# Altium schematic sheet SH26 - ENET PORTS.SchDoc
size 386 x 246 mm
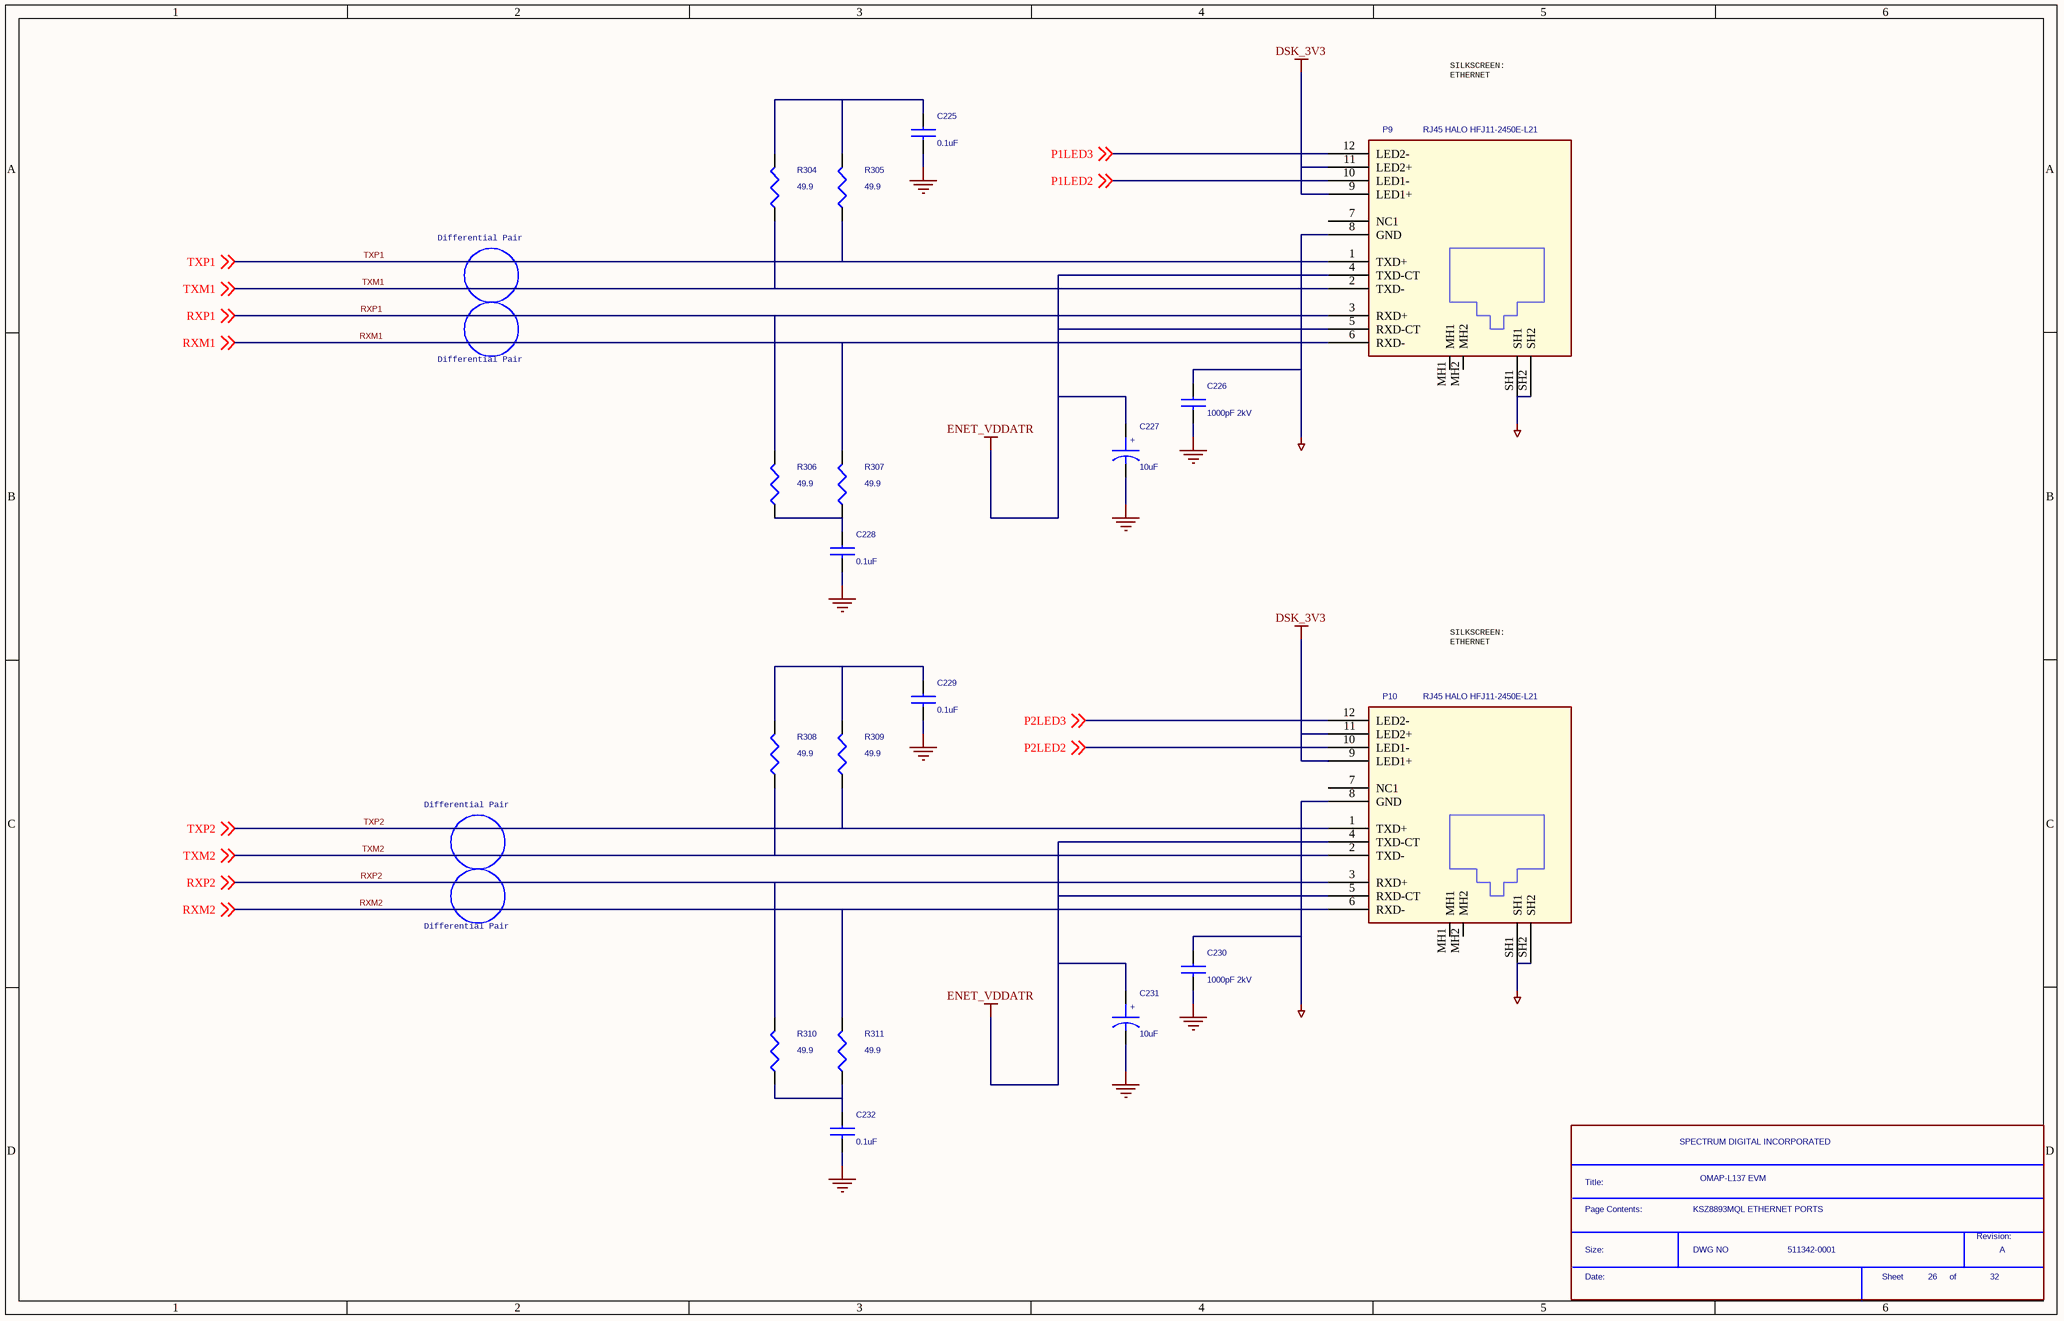
[diagram p0: SH26 - ENET PORTS.SchDoc]

## Parts
*  Page Contents:: KSZ8893MQL ETHERNET PORTS  RevCode: A  Title: OMAP-L137 EVM  OrgName: SPECTRUM DIGITAL INCORPORATED  Doc: 511342-0001  Page Number: 26  Page Count: 32  (hidden comment: SDTitleBlock)  (graphical)
C225  0.1uF  [c402-25]
C226  1000pF 2kV  [EIA1812]
C227  10uF  [c1206-40x70-POL]
C228  0.1uF  [c402-25]
C229  0.1uF  [c402-25]
C230  1000pF 2kV  [EIA1812]
C231  10uF  [c1206-40x70-POL]
C232  0.1uF  [c402-25]
P9  RJ45 HALO HFJ11-2450E-L21  [RJ45AMP556591-1]
P10  RJ45 HALO HFJ11-2450E-L21  [RJ45AMP556591-1]
R304  49.9  [r603-35x45]
R305  49.9  [r603-35x45]
R306  49.9  [r603-35x45]
R307  49.9  [r603-35x45]
R308  49.9  [r603-35x45]
R309  49.9  [r603-35x45]
R310  49.9  [r603-35x45]
R311  49.9  [r603-35x45]

## Nets
DSK_3V3: P9.9(LED1+) P9.11(LED2+) P10.9(LED1+) P10.11(LED2+)
ENET_VDDATR: C227.1 C231.1 P9.4(TXD-CT) P9.5(RXD-CT) P10.4(TXD-CT) P10.5(RXD-CT)
GND: C225.2 C226.2 C227.2 C228.2 C229.2 C230.2 C231.2 C232.2
GND_E_ENET: C226.1 C230.1 P9.8(GND) P9.SH1 P9.SH2 P10.8(GND) P10.SH1 P10.SH2
P1LED2: P9.10(LED1-) ; off-sheet P1LED2
P1LED3: P9.12(LED2-) ; off-sheet P1LED3
P2LED2: P10.10(LED1-) ; off-sheet P2LED2
P2LED3: P10.12(LED2-) ; off-sheet P2LED3
RXM1: P9.6(RXD-) R307.2 ; off-sheet RXM1
RXM2: P10.6(RXD-) R311.2 ; off-sheet RXM2
RXP1: P9.3(RXD+) R306.2 ; off-sheet RXP1
RXP2: P10.3(RXD+) R310.2 ; off-sheet RXP2
TXM1: P9.2(TXD-) R304.1 ; off-sheet TXM1
TXM2: P10.2(TXD-) R308.1 ; off-sheet TXM2
TXP1: P9.1(TXD+) R305.1 ; off-sheet TXP1
TXP2: P10.1(TXD+) R309.1 ; off-sheet TXP2
NetC225_1: C225.1 R304.2 R305.2
NetC228_1: C228.1 R306.1 R307.1
NetC229_1: C229.1 R308.2 R309.2
NetC232_1: C232.1 R310.1 R311.1

Not connected (* = marked no-connect by the designer): P9 7(NC1) MH1 MH2; P10 7(NC1) MH1 MH2

## Notes on the sheet
- SILKSCREEN:
  ETHERNET
- Differential Pair
- (in symbol CAPACITOR POL_0) +
- (in symbol SDTitleBlock) Title:; Page Contents:; Revision:; Size:; DWG NO; Date:; Sheet; of

## Library data of the parts
C225 C228 C229 C232 = CAP NP: Part #: 101587-1100R
C226 C230 = CAP NP: Part #: 101583-1102R
C227 C231 = CAPACITOR POL_0: Part #: 101003-0101R
P9 P10 = RJ45_2: RJ45 Jack with 2 LEDs shielded; NCPartnumber: 2J0005; Mfr: Amphenol; PartName: RJ45w2LEDs; Part #: 102166-0001R; Cost100: 2.31; Vendor: Newark; Cost10K: 1.87; MfrNum: RJHS-5385
R304-R311 = RESISTOR: Part #: 100642-4990R